# Altium schematic sheet Analog_Channel_Test.SchDoc
size A4; SheetNumber: 1; SheetTotal: 9
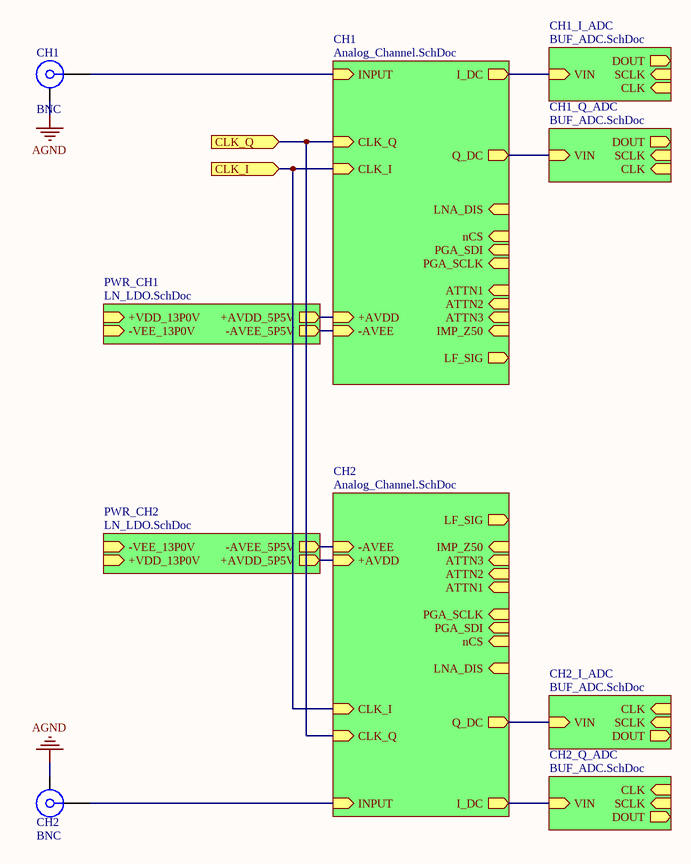
[diagram p0: Analog_Channel_Test.SchDoc]

## Parts
CH1  BNC  [BNC-TYCO_1-1337542-0]
CH2  BNC  [BNC-TYCO_1-1337542-0]

## Sub-sheets
CH1 = Analog_Channel.SchDoc: INPUT (in), I_DC (out), Q_DC (out), CLK_Q (in), CLK_I (in), nCS (in), PGA_SDI (in), PGA_SCLK (in), LF_SIG (out), ATTN3 (in), ATTN2 (in), ATTN1 (in), IMP_Z50 (in), LNA_DIS (in), +AVDD (in), -AVEE (in)
CH1_I_ADC = BUF_ADC.SchDoc: VIN (in), CLK (in), SCLK (in), DOUT (out)
CH1_Q_ADC = BUF_ADC.SchDoc: VIN (in), CLK (in), SCLK (in), DOUT (out)
CH2 = Analog_Channel.SchDoc: INPUT (in), I_DC (out), Q_DC (out), CLK_Q (in), CLK_I (in), nCS (in), PGA_SDI (in), PGA_SCLK (in), LF_SIG (out), ATTN3 (in), ATTN2 (in), ATTN1 (in), IMP_Z50 (in), LNA_DIS (in), +AVDD (in), -AVEE (in)
CH2_I_ADC = BUF_ADC.SchDoc: VIN (in), CLK (in), SCLK (in), DOUT (out)
CH2_Q_ADC = BUF_ADC.SchDoc: VIN (in), CLK (in), SCLK (in), DOUT (out)
PWR_CH1 = LN_LDO.SchDoc: +AVDD_5P5V (out), -AVEE_5P5V (out), +VDD_13P0V (in), -VEE_13P0V (in)
PWR_CH2 = LN_LDO.SchDoc: +AVDD_5P5V (out), -AVEE_5P5V (out), +VDD_13P0V (in), -VEE_13P0V (in)

## Ports
CLK_I (in), CLK_Q (in)

## Nets
AGND: CH1.MH CH2.MH
CLK_I: port CLK_I, sheet CH1/CLK_I, sheet CH2/CLK_I
CLK_Q: port CLK_Q, sheet CH1/CLK_Q, sheet CH2/CLK_Q
NetCH1_1: CH1.1 ; sheet CH1/INPUT
NetCH2_1: CH2.1 ; sheet CH2/INPUT
(unnamed): sheet CH1/I_DC, sheet CH1_I_ADC/VIN
(unnamed): sheet CH1/Q_DC, sheet CH1_Q_ADC/VIN
(unnamed): sheet CH1/+AVDD, sheet PWR_CH1/+AVDD_5P5V
(unnamed): sheet CH1/-AVEE, sheet PWR_CH1/-AVEE_5P5V
(unnamed): sheet CH2/I_DC, sheet CH2_Q_ADC/VIN
(unnamed): sheet CH2/Q_DC, sheet CH2_I_ADC/VIN
(unnamed): sheet CH2/+AVDD, sheet PWR_CH2/+AVDD_5P5V
(unnamed): sheet CH2/-AVEE, sheet PWR_CH2/-AVEE_5P5V

## Library data of the parts
CH1 CH2 = BNC: BNC-KE PIN 6.9mm distance; PartNumber: 51K101-400A4; Design Note: Footprint in library is a generic example - only application specific footprint delivers High Performance; DatasheetVersion: c00; PackageVersion: c00; PackageReference: 51K101-400A4; PackageDescription: 50R BNC Straight Jack, 12 x 12 x 15 mm; Mounting Technology: Through Hole; ComponentLink1Description: Manufacturer URL; ComponentLink1URL: http://www.rosenberger.de; ComponentLink2Description: Datasheet; ComponentLink2URL: http://rosenberger.de/ok/images/documents/db/51K101-400A4.pdf; ComponentLink3Description: Package Specification; ComponentLink3URL: http://rosenberger.de/ok/images/documents/db/51K101-400A4.pdf; ComponentLink4Description: URL Link1; ComponentLink4URL: Series Overview / Design Note:http://rosenberger.de/ok/images/documents/spez/51.pdf; ComponentLink5Description: Webshop / RFQ; ComponentLink5URL: http://www.rosenberger.com/en/contact/sales/